# EAGLE schematic pi_pcb (EAGLE 9.5.2)
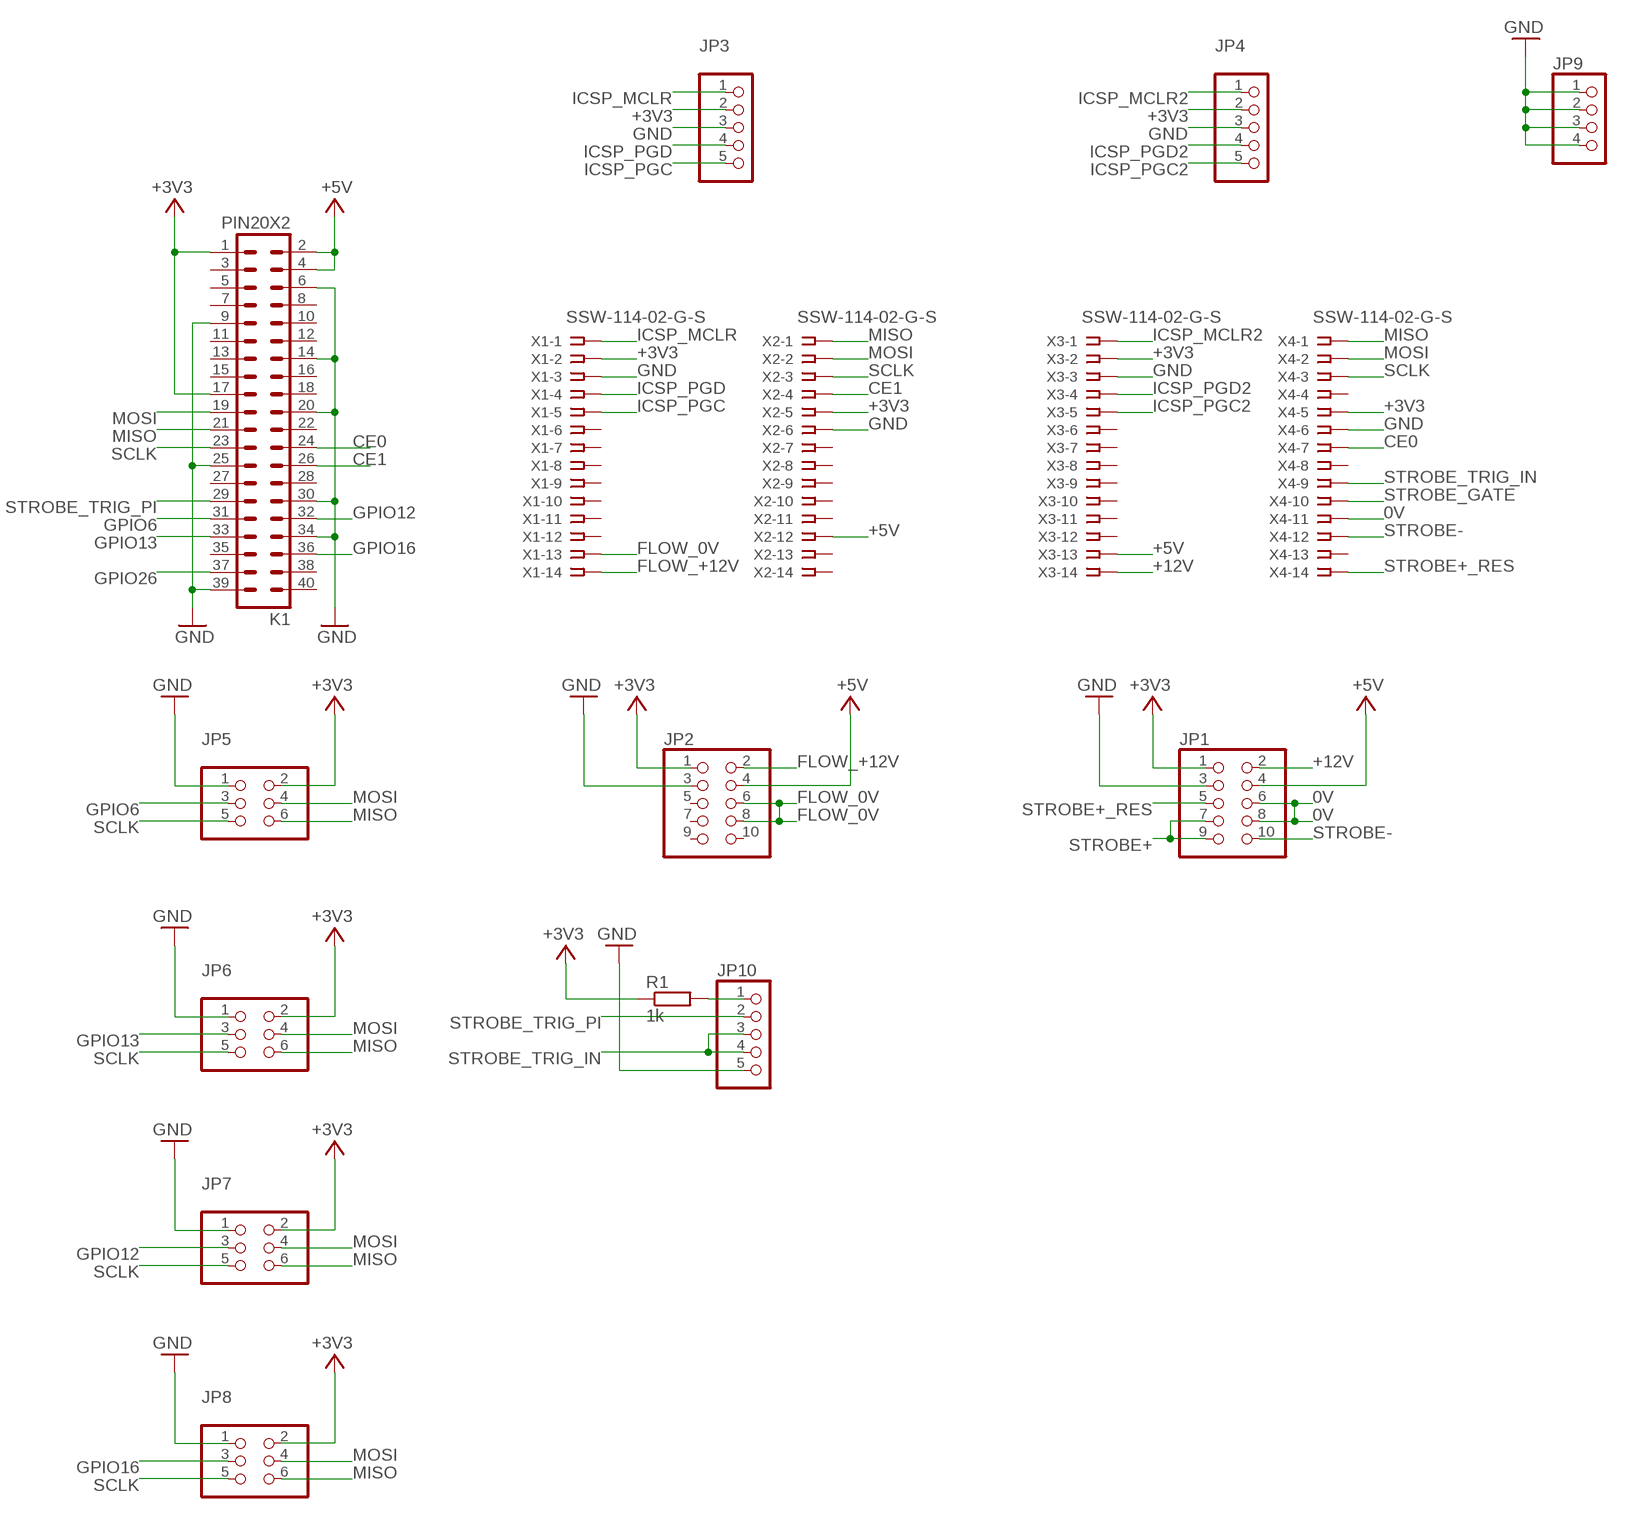
[diagram p0: schematic, sheet 1]

## Parts
JP1  PINHD-2X5  [2X05]
JP2  PINHD-2X5  [2X05]
JP3  PINHD-1X5  [1X05]
JP4  PINHD-1X5  [1X05]
JP5  PINHD-2X3  [2X03]
JP6  PINHD-2X3  [2X03]
JP7  PINHD-2X3  [2X03]
JP8  PINHD-2X3  [2X03]
JP9  PINHD-1X4  [1X04]
JP10  PINHD-1X5  [1X05]
K1  PIN20X2  [PIN_20X2]
R1  1k  R-EU_R1206  [R1206]
X1  SSW-114-02-G-S  [SSW-114-02-G-S]
X2  SSW-114-02-G-S  [SSW-114-02-G-S]
X3  SSW-114-02-G-S  [SSW-114-02-G-S]
X4  SSW-114-02-G-S  [SSW-114-02-G-S]

## Nets
0V: JP1.6 JP1.8 X4.11
+3V3: JP1.1 JP2.1 JP3.2 JP4.2 JP5.2 JP6.2 JP7.2 JP8.2 K1.1 K1.17 R1.1 X1.2 X2.5 X3.2 X4.5
+5V: JP1.4 JP2.4 K1.2 K1.4 X2.12 X3.13
+12V: JP1.2 X3.14
CE0: K1.24 X4.7
CE1: K1.26 X2.4
FLOW_0V: JP2.6 JP2.8 X1.13
FLOW_+12V: JP2.2 X1.14
GND: JP1.3 JP2.3 JP3.3 JP4.3 JP5.1 JP6.1 JP7.1 JP8.1 JP9.1 JP9.2 JP9.3 JP9.4 JP10.5 K1.6 K1.9 K1.14 K1.20 K1.25 K1.30 K1.34 K1.39 X1.3 X2.6 X3.3 X4.6
GPIO6: JP5.3 K1.31
GPIO12: JP7.3 K1.32
GPIO13: JP6.3 K1.33
GPIO16: JP8.3 K1.36
GPIO26: K1.37
ICSP_MCLR: JP3.1 X1.1
ICSP_MCLR2: JP4.1 X3.1
ICSP_PGC: JP3.5 X1.5
ICSP_PGC2: JP4.5 X3.5
ICSP_PGD: JP3.4 X1.4
ICSP_PGD2: JP4.4 X3.4
MISO: JP5.6 JP6.6 JP7.6 JP8.6 K1.21 X2.1 X4.1
MOSI: JP5.4 JP6.4 JP7.4 JP8.4 K1.19 X2.2 X4.2
N$1: JP10.1 R1.2
SCLK: JP5.5 JP6.5 JP7.5 JP8.5 K1.23 X2.3 X4.3
STROBE+: JP1.7 JP1.9
STROBE+_RES: JP1.5 X4.14
STROBE-: JP1.10 X4.12
STROBE_GATE: X4.10
STROBE_TRIG_IN: JP10.3 JP10.4 X4.9
STROBE_TRIG_PI: JP10.2 K1.29
Unconnected: JP2.5 JP2.7 JP2.9 JP2.10 K1.3 K1.5 K1.7 K1.8 K1.10 K1.11 K1.12 K1.13 K1.15 K1.16 K1.18 K1.22 K1.27 K1.28 K1.35 K1.38 K1.40 X1.6 X1.7 X1.8 X1.9 X1.10 X1.11 X1.12 X2.7 X2.8 X2.9 X2.10 X2.11 X2.13 X2.14 X3.6 X3.7 X3.8 X3.9 X3.10 X3.11 X3.12 X4.4 X4.8 X4.13

## Library data of the parts
JP1 JP2 = pinhead:PINHD-2X5: PIN HEADER
JP3 JP4 JP10 = pinhead:PINHD-1X5: PIN HEADER
JP5-JP8 = pinhead:PINHD-2X3: PIN HEADER
JP9 = pinhead:PINHD-1X4: PIN HEADER
K1 = FLYFISH:PIN20X2; OC_FARNELL: unknown
R1 = rcl:R-EU_: RESISTOR, European symbol; SPICEPREFIX: R
X1-X4 = con-samtec:SSW-114-02-G-S: THROUGH-HOLE .025" SQ POST SOCKET Source: Samtec SSW.pdf; MF: Samtec Inc.; MPN: SSW-114-02-G-S; OC_FARNELL: unknown; OC_NEWARK: 11P9549